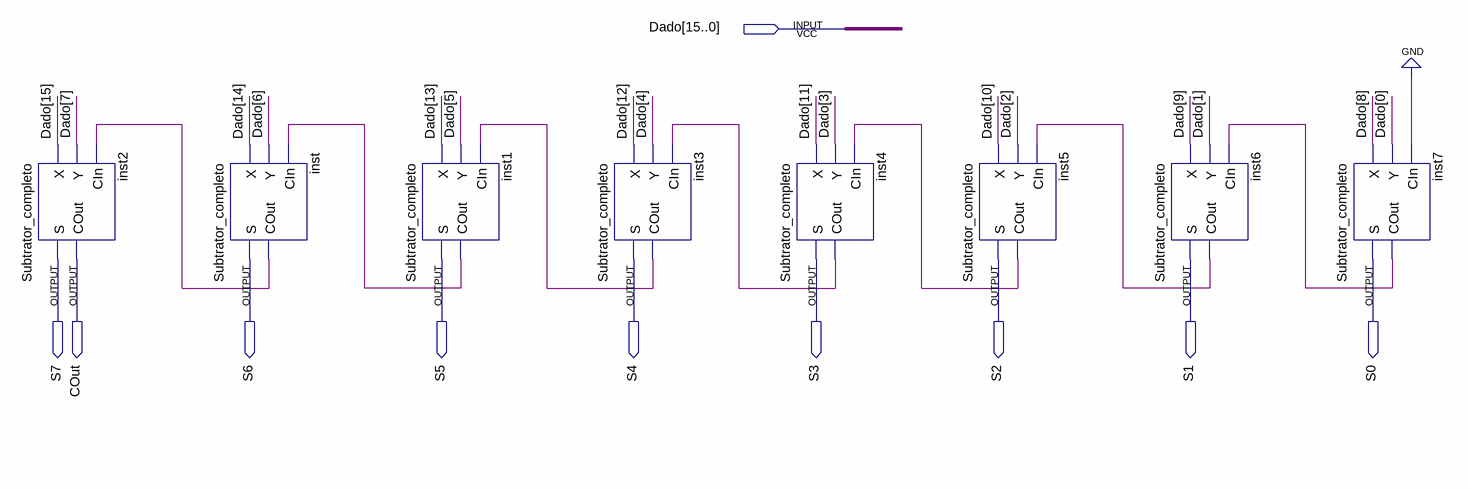
[diagram p0: schematic sheet]
// Quartus schematic Subtrator_8bits.bdf as structural Verilog: 8 symbols, 10 pins
module Subtrator_8bits (
  input  [15:0] Dado,
  output S7,
  output COut,
  output S6,
  output S5,
  output S4,
  output S3,
  output S2,
  output S1,
  output S0
);

  wire inst1_cout, inst3_cout, inst4_cout, inst5_cout, inst6_cout, inst7_cout, inst_cout;

  Subtrator_completo inst2 (.X(Dado[15]), .Y(Dado[7]), .CIn(inst_cout), .S(S7), .COut(COut));
  Subtrator_completo inst (.X(Dado[14]), .Y(Dado[6]), .CIn(inst1_cout), .S(S6), .COut(inst_cout));
  Subtrator_completo inst1 (.X(Dado[13]), .Y(Dado[5]), .CIn(inst3_cout), .S(S5), .COut(inst1_cout));
  Subtrator_completo inst3 (.X(Dado[12]), .Y(Dado[4]), .CIn(inst4_cout), .S(S4), .COut(inst3_cout));
  Subtrator_completo inst4 (.X(Dado[11]), .Y(Dado[3]), .CIn(inst5_cout), .S(S3), .COut(inst4_cout));
  Subtrator_completo inst5 (.X(Dado[10]), .Y(Dado[2]), .CIn(inst6_cout), .S(S2), .COut(inst5_cout));
  Subtrator_completo inst6 (.X(Dado[9]), .Y(Dado[1]), .CIn(inst7_cout), .S(S1), .COut(inst6_cout));
  Subtrator_completo inst7 (.X(Dado[8]), .Y(Dado[0]), .CIn(1'b0), .S(S0), .COut(inst7_cout));
endmodule
